# Altium schematic sheet TrickleCharging.SchDoc
size A4
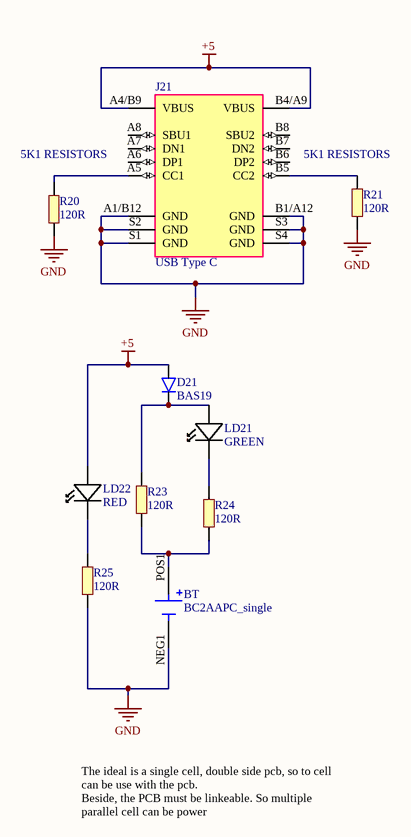
[diagram p0: TrickleCharging.SchDoc]

## Parts
BT  BC2AAPC_single  [BAT_BC2AAPC_single]
D21  BAS19  [SOT-23]
J21  USB Type C  [GCT_USB4110-GF-A_REVB]
LD21  GREEN  [LED 3X1.5]
LD22  RED  [LED 3X1.5]
R20  120R  [RESC2012X60N]
R21  120R  [RESC2012X60N]
R23  120R  [RESC2012X60N]
R24  120R  [RESC2012X60N]
R25  120R  [RESC2012X60N]

## Nets
+5: D21.1(A) J21.A4/B9(VBUS) J21.B4/A9(VBUS) LD22.1(AR)
GND: BT.NEG1 J21.A1/B12(GND) J21.B1/A12(GND) J21.S1(GND) J21.S2(GND) J21.S3(GND) J21.S4(GND) R20.1 R21.1 R25.1
NetBT_POS1: BT.POS1 R23.1 R24.1
NetD21_3: D21.3(K) LD21.1(AR) R23.2
NetJ21_A5: J21.A5(CC1) R20.2
NetJ21_B5: J21.B5(CC2) R21.2
NetLD21_2: LD21.2(KR) R24.2
NetLD22_2: LD22.2(KR) R25.2

Not connected (* = marked no-connect by the designer): J21 A6(DP1) A7(DN1) A8(SBU1) B6(DP2) B7(DN2) B8(SBU2)

## Notes on the sheet
- (near R20) 5K1 RESISTORS
- 5K1 RESISTORS
- The ideal is a single cell, double side pcb, so to cell can be use with the pcb.
  Beside, the PCB must be linkeable. So multiple parallel cell can be power
  from a single USB

## Library data of the parts
BT = BC2AAPC_single: BATTERY HOLDER AA 1 CELL PC PIN; MF: MPD; Value: *; SnapEDA_Link: https://www.snapeda.com/parts/BC2AAPC/MPD/view-part/4389051/?ref=snap; Price: None; Availability: Unavailable; Package: None; MP: BC2AAPC
D21 = BAS19: Diode Standard 250V 200mA Surface Mount SOT-23-3 _TO-236_; MF: onsemi; MP: BAS19LT1G; Value: BAS19; SnapEDA_Link: https://www.snapeda.com/parts/BAS21/ON%20Semiconductor/view-part/2747894/?ref=snap; Price: US$0.0277; Availability: Unavailable; Package: SOT-23-3 Rectron; LCSC: C232582
J21 = USB4110-GF-A_REVB: USB-C (USB TYPE-C) USB 2.0 Type C. Receptacle Connector 24 (16+8 Dummy) Position Surface Mount, Right Angle; Through Hole; MF: GCT; Value: USB Type C; Price: None; Package: None; SnapEDA_Link: https://www.snapeda.com/parts/USB4110-GF-A/Global%20Connector%20Technology/view-part/4001167/?ref=snap; Availability: Warning; MP: USB4110-GF-A; Purchase-URL: https://pricing.snapeda.com/search/part/USB4110-GF-A/?ref=eda; Check_prices: https://www.snapeda.com/parts/USB4110-GF-A/Global%20Connector%20Technology/view-part/4001167/?ref=eda; Mouser: 640-USB4110-GF-A; LSCS: *
LD21 = LED GREEN: Standard LED 1206; Type: KINGBRIGHT; UA P/N: 15-0020; Value: GREEN
LD22 = LED RED: Standard LED 1206; Type: KINGBRIGHT; UA P/N: 15-0021; Value: RED
R20 R21 R23-R25 = RES0805_120R: 1/10W ±1% 120Ω ±100ppm/℃ 0805; Value: 120R; Footprint: 0805; Type: THICK FILM; Price: US$0.0018